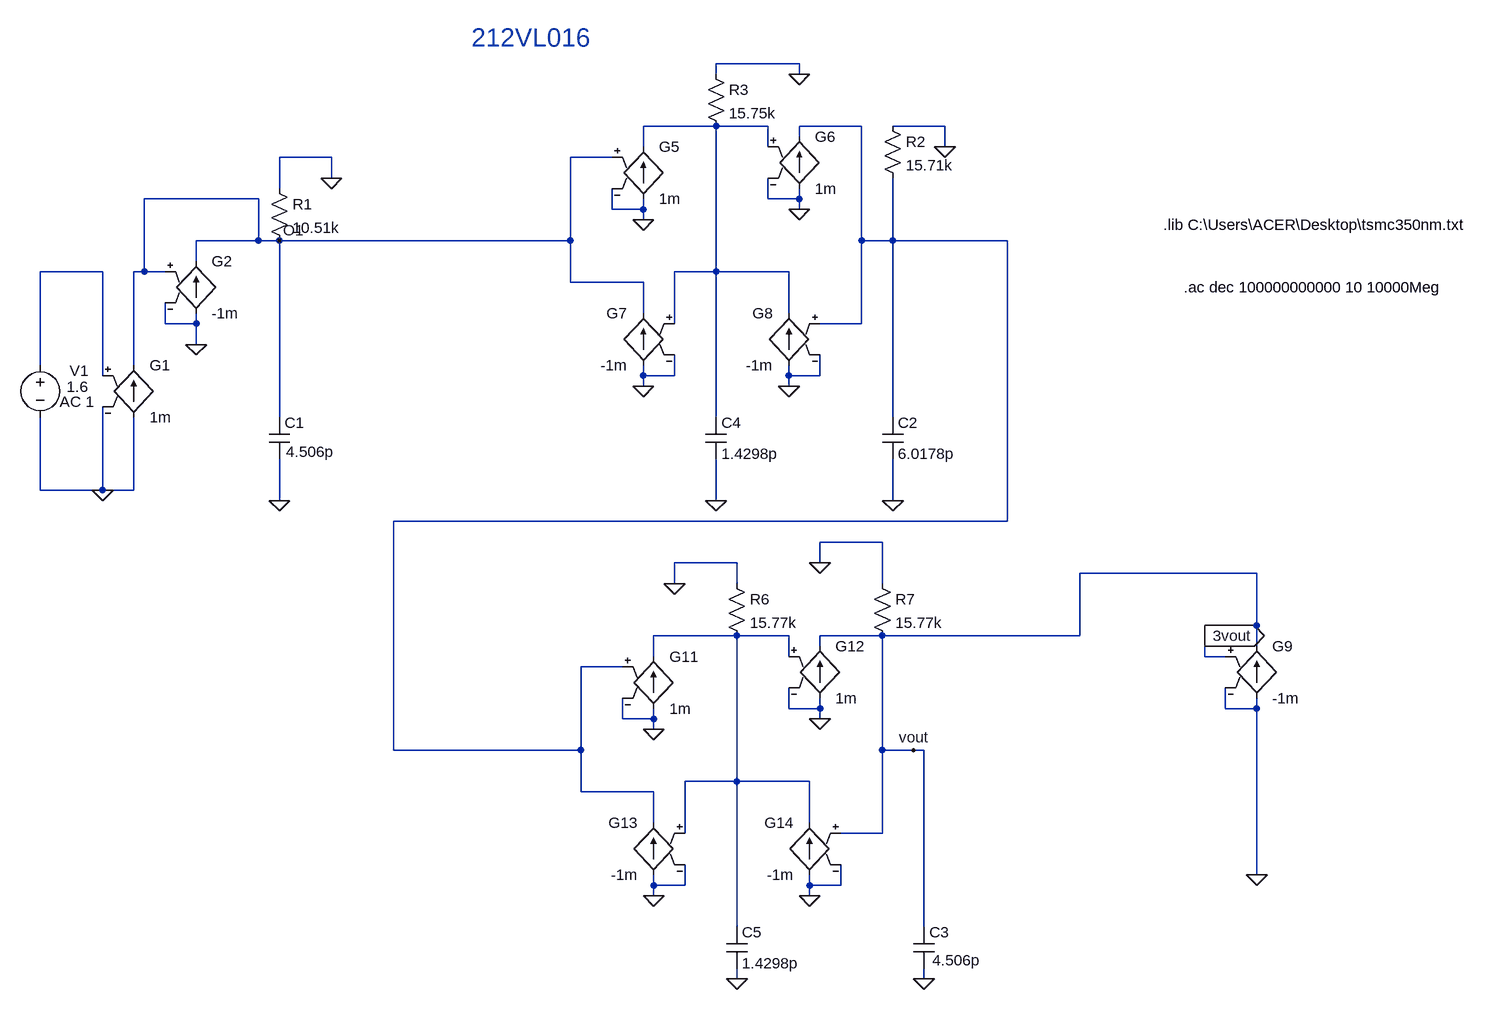
[diagram p0: schematic q3b.asc]
q3b.asc, the LTspice schematic file:
Version 4
SHEET 1 1920 3276
WIRE 240 -144 112 -144
WIRE 112 -128 112 -144
WIRE 240 -128 240 -144
WIRE 112 -48 0 -48
WIRE 192 -48 112 -48
WIRE 336 -48 240 -48
WIRE 464 -48 384 -48
WIRE 240 -32 240 -48
WIRE 0 -16 0 -48
WIRE 192 -16 192 -48
WIRE 464 -16 464 -48
WIRE -480 0 -560 0
WIRE -48 0 -112 0
WIRE -480 32 -480 0
WIRE -560 48 -560 0
WIRE -592 64 -768 64
WIRE 192 64 192 32
WIRE 240 64 240 48
WIRE 240 64 192 64
WIRE -48 80 -48 48
WIRE 0 80 0 64
WIRE 0 80 -48 80
WIRE 240 80 240 64
WIRE 0 96 0 80
WIRE -592 128 -592 64
WIRE -592 128 -688 128
WIRE -560 128 -592 128
WIRE -112 128 -112 0
WIRE -112 128 -560 128
WIRE 336 128 336 -48
WIRE 384 128 384 32
WIRE 384 128 336 128
WIRE 560 128 384 128
WIRE -688 160 -688 128
WIRE -832 176 -928 176
WIRE -768 176 -768 64
WIRE -768 176 -784 176
WIRE -736 176 -768 176
WIRE 112 176 112 -48
WIRE 112 176 48 176
WIRE 224 176 112 176
WIRE -112 192 -112 128
WIRE 0 192 -112 192
WIRE 0 240 0 192
WIRE 224 240 224 176
WIRE -736 256 -736 224
WIRE -688 256 -688 240
WIRE -688 256 -736 256
WIRE 48 256 48 176
WIRE 336 256 336 128
WIRE 336 256 272 256
WIRE -688 288 -688 256
WIRE -928 320 -928 176
WIRE -784 320 -784 176
WIRE -832 336 -832 176
WIRE 0 336 0 320
WIRE 48 336 48 304
WIRE 48 336 0 336
WIRE 224 336 224 320
WIRE 272 336 272 304
WIRE 272 336 224 336
WIRE 0 352 0 336
WIRE 224 352 224 336
WIRE -560 400 -560 128
WIRE 112 400 112 176
WIRE 384 400 384 128
WIRE -928 512 -928 400
WIRE -832 512 -832 384
WIRE -832 512 -928 512
WIRE -784 512 -784 400
WIRE -784 512 -832 512
WIRE -560 528 -560 464
WIRE 112 528 112 464
WIRE 384 528 384 464
WIRE 560 560 560 128
WIRE 560 560 -384 560
WIRE 368 592 272 592
WIRE 144 624 48 624
WIRE 272 624 272 592
WIRE 944 640 672 640
WIRE 48 656 48 624
WIRE 144 656 144 624
WIRE 368 656 368 592
WIRE 944 720 944 640
WIRE 944 720 864 720
WIRE 144 736 16 736
WIRE 224 736 144 736
WIRE 368 736 272 736
WIRE 672 736 672 640
WIRE 672 736 368 736
WIRE 864 736 864 720
WIRE 272 752 272 736
WIRE 944 752 944 720
WIRE 16 768 16 736
WIRE 224 768 224 736
WIRE 864 768 864 736
WIRE 896 768 864 768
WIRE -32 784 -96 784
WIRE 224 848 224 816
WIRE 272 848 272 832
WIRE 272 848 224 848
WIRE 896 848 896 816
WIRE 944 848 944 832
WIRE 944 848 896 848
WIRE -32 864 -32 832
WIRE 16 864 16 848
WIRE 16 864 -32 864
WIRE 272 864 272 848
WIRE 16 880 16 864
WIRE -384 912 -384 560
WIRE -96 912 -96 784
WIRE -96 912 -384 912
WIRE 368 912 368 736
WIRE 416 912 368 912
WIRE 432 912 416 912
WIRE 144 960 144 736
WIRE 144 960 64 960
WIRE 256 960 144 960
WIRE -96 976 -96 912
WIRE 16 976 -96 976
WIRE 16 1024 16 976
WIRE 256 1024 256 960
WIRE 64 1040 64 960
WIRE 368 1040 368 912
WIRE 368 1040 304 1040
WIRE 944 1104 944 848
WIRE 16 1120 16 1104
WIRE 64 1120 64 1088
WIRE 64 1120 16 1120
WIRE 256 1120 256 1104
WIRE 304 1120 304 1088
WIRE 304 1120 256 1120
WIRE 16 1136 16 1120
WIRE 256 1136 256 1120
WIRE 144 1184 144 960
WIRE 432 1184 432 912
WIRE 144 1264 144 1248
WIRE 432 1264 432 1248
FLAG -688 288 0
FLAG -832 512 0
FLAG -560 528 0
FLAG 0 352 0
FLAG 0 96 0
FLAG 240 80 0
FLAG 224 352 0
FLAG 112 528 0
FLAG 384 528 0
FLAG 16 1136 0
FLAG 16 880 0
FLAG 272 864 0
FLAG 256 1136 0
FLAG 144 1264 0
FLAG 432 1264 0
FLAG 416 912 vout
FLAG -480 32 0
FLAG 240 -128 0
FLAG 464 -16 0
FLAG 48 656 0
FLAG 272 624 0
FLAG -560 128 O1
FLAG 944 1104 0
FLAG 864 736 3vout
IOPIN 864 736 Out
SYMBOL cap -576 400 R0
WINDOW 3 26 53 Left 2
SYMATTR Value 4.506p
SYMATTR InstName C1
SYMBOL cap 368 400 R0
SYMATTR InstName C2
SYMATTR Value 6.0178p
SYMBOL cap 416 1184 R0
WINDOW 3 29 51 Left 2
SYMATTR Value 4.506p
SYMATTR InstName C3
SYMBOL voltage -928 304 R0
WINDOW 123 30 72 Left 2
WINDOW 39 0 0 Left 0
WINDOW 0 45 24 Left 2
WINDOW 3 41 49 Left 2
SYMATTR Value2 AC 1
SYMATTR InstName V1
SYMATTR Value 1.6
SYMBOL g -784 304 R0
SYMATTR InstName G1
SYMATTR Value 1m
SYMBOL g -688 144 R0
SYMATTR InstName G2
SYMATTR Value -1m
SYMBOL g 0 -32 R0
SYMATTR InstName G5
SYMATTR Value 1m
SYMBOL g 240 -48 R0
SYMATTR InstName G6
SYMATTR Value 1m
SYMBOL g 0 224 M0
SYMATTR InstName G7
SYMATTR Value -1m
SYMBOL g 224 224 M0
SYMATTR InstName G8
SYMATTR Value -1m
SYMBOL cap 96 400 R0
SYMATTR InstName C4
SYMATTR Value 1.4298p
SYMBOL g 16 752 R0
SYMATTR InstName G11
SYMATTR Value 1m
SYMBOL g 272 736 R0
SYMATTR InstName G12
SYMATTR Value 1m
SYMBOL g 16 1008 M0
SYMATTR InstName G13
SYMATTR Value -1m
SYMBOL g 256 1008 M0
SYMATTR InstName G14
SYMATTR Value -1m
SYMBOL cap 128 1184 R0
SYMATTR InstName C5
SYMATTR Value 1.4298p
SYMBOL res -576 32 R0
SYMATTR InstName R1
SYMATTR Value 10.51k
SYMBOL res 96 -144 R0
SYMATTR InstName R3
SYMATTR Value 15.75k
SYMBOL res 128 640 R0
SYMATTR InstName R6
SYMATTR Value 15.77k
SYMBOL res 352 640 R0
SYMATTR InstName R7
SYMATTR Value 15.77k
SYMBOL g 944 736 R0
SYMATTR InstName G9
SYMATTR Value -1m
SYMBOL res 368 -64 R0
SYMATTR InstName R2
SYMATTR Value 15.71k
TEXT -264 -184 Left 4 ;212VL016
TEXT 800 104 Left 2 !.lib C:\\Users\\ACER\\Desktop\\tsmc350nm.txt
TEXT 832 200 Left 2 !.ac dec 100000000000 10 10000Meg

The netlist it stands for:
* q3b.asc
C1 O1 0 4.506p
C2 N002 0 6.0178p
C3 3vout 0 4.506p
V1 N003 0 1.6 AC 1
G1 0 O1 N003 0 1m
G2 0 O1 O1 0 -1m
G5 0 N001 O1 0 1m
G6 0 N002 N001 0 1m
G7 0 O1 N001 0 -1m
G8 0 N001 N002 0 -1m
C4 N001 0 1.4298p
G11 0 N004 N002 0 1m
G12 0 3vout N004 0 1m
G13 0 N002 N004 0 -1m
G14 0 N004 3vout 0 -1m
C5 N004 0 1.4298p
R1 0 O1 10.51k
R3 0 N001 15.75k
R6 0 N004 15.77k
R7 0 3vout 15.77k
G9 0 3vout 3vout 0 -1m
R2 0 N002 15.71k
* 212VL016
.lib C:\Users\ACER\Desktop\tsmc350nm.txt
.ac dec 100000000000 10 10000Meg
.backanno
.end